# Altium schematic sheet USB.SchDoc: USB interface
size A3; DrawnBy: Mogens Groth Nicolaisen; DocumentNumber: 6; SheetNumber: 6; SheetTotal: 7
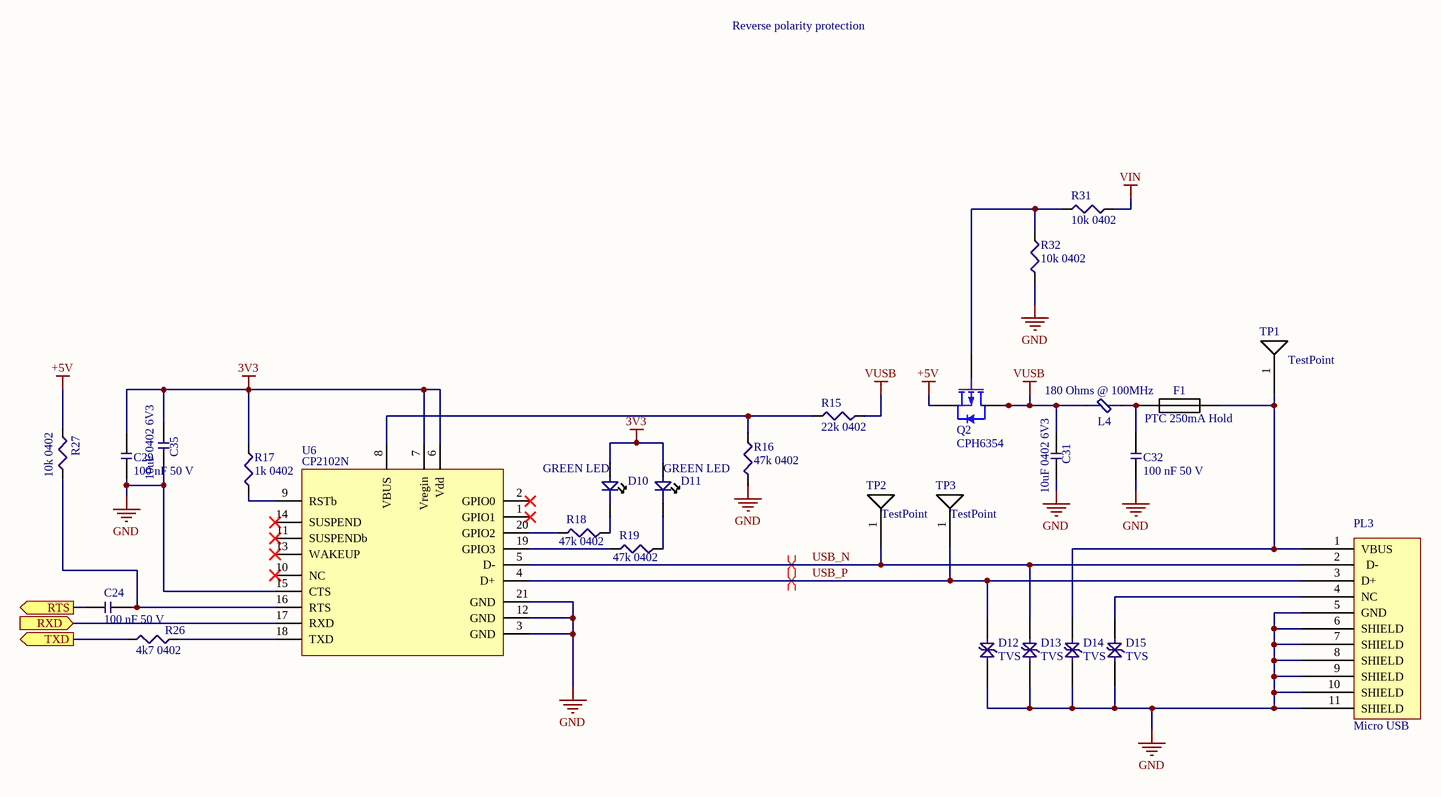
[diagram p0: USB.SchDoc]

## Parts
C24  100 nF 50 V  [CAP_0402]
C29  100 nF 50 V  [CAP_0402]
C31  10uF 0402 6V3  [CAP_0402]
C32  100 nF 50 V  [CAP_0402]
C35  10uF 0402 6V3  [CAP_0402]
D10  GREEN LED  [0402 LED]
D11  GREEN LED  [0402 LED]
D12  TVS  [RES_0402]
D13  TVS  [RES_0402]
D14  TVS  [RES_0402]
D15  TVS  [RES_0402]
F1  PTC 250mA Hold  [PTC Fuse 1206]
L4  180 Ohms @ 100MHz  [IND_0603]
PL3  Micro USB  [10118193-0001LF Micro USB]
Q2  CPH6354  [SOT95P280X95-6N]
R15  22k 0402  [RES_0402]
R16  47k 0402  [RES_0402]
R17  1k 0402  [RES_0402]
R18  47k 0402  [RES_0402]
R19  47k 0402  [RES_0402]
R26  4k7 0402  [RES_0402]
R27  10k 0402  [RES_0402]
R31  10k 0402  [RES_0402]
R32  10k 0402  [RES_0402]
TP1  TestPoint  [1x0mm]  (no BOM)
TP2  TestPoint  [1x0mm]  (no BOM)
TP3  TestPoint  [1x0mm]  (no BOM)
U6  CP2102N  [QFN50P300X300X80_HS-21N]

## Ports
RTS (out), RXD (in), TXD (out)

## Nets
3V3: C29.1 C35.2 D10.1 D11.1 R17.2 U6.6(Vdd) U6.7(Vregin)
+5V: Q2.4(SOURCE) R27.2
GND: C29.2 C31.1 C32.2 C35.1 D12.1(Anode) D13.1(Anode) D14.1(Anode) D15.1(Anode) PL3.5(GND) PL3.6(SHIELD) PL3.7(SHIELD) PL3.8(SHIELD) PL3.9(SHIELD) PL3.10(SHIELD) PL3.11(SHIELD) R16.1 R32.2 U6.3(GND) U6.12(GND) U6.15(CTS) U6.21(GND)
VIN: R31.1
VUSB: C31.2 L4.1 Q2.1(DRAIN) Q2.2(DRAIN) Q2.5(DRAIN) Q2.6(DRAIN) R15.2
RTS: C24.1 ; port RTS
RXD: U6.17(RXD) ; port RXD
TXD: R26.2 ; port TXD
USB_N: D13.2(Cathode) PL3.2(D-) TP2.1 U6.5(D-)
USB_P: D12.2(Cathode) PL3.3(D+) TP3.1 U6.4(D+)
NetC24_2: C24.2 R27.1 U6.16(RTS)
NetC32_1: C32.1 F1.1 L4.2
NetD10_2: D10.2 R18.1
NetD11_2: D11.2 R19.1
NetD14_2: D14.2(Cathode) F1.2 PL3.1(VBUS) TP1.1
NetD15_2: D15.2(Cathode) PL3.4(NC)
NetQ2_3: Q2.3(GATE) R31.2 R32.1
NetR15_1: R15.1 R16.2 U6.8(VBUS)
NetR17_1: R17.1 U6.9(RSTb)
NetR18_2: R18.2 U6.20(GPIO2)
NetR19_2: R19.2 U6.19(GPIO3)
NetR26_1: R26.1 U6.18(TXD)

Not connected (* = marked no-connect by the designer): U6 1(GPIO1)* 2(GPIO0)* 10(NC)* 11(SUSPENDb)* 13(WAKEUP)* 14(SUSPEND)*

## Layout directives
differential pair: USB_N, USB_P

## Notes on the sheet
- Reverse polarity protection
- ON Development
- Title:
- Size:
- A3
- Drawn By:
- Date:
- Sheet
- of
- Revision:

## Library data of the parts
C24 C29 C32 = CMP-00088-2: Multilayer Ceramic Capacitors MLCC - SMD/SMT .1uF 50Volts X7R +/-10% 0402 STD; Tolerance: 10%; Value: 100nF; Voltage: 50 V; Voltage Rating (DC): 50V; Capacitance: 100nF; Case/Package: 0402; Case Code (Imperial): 0402; Case Code (Metric): 1005; Dielectric: X7R; Halogen Free: Halogen Free; Height: 0.5mm; Lead Free: Lead Free; Length: 0.039inch; Max Operating Temperature: 125°C; Min Operating Temperature: -55°C; Mount: Surface Mount; Package Quantity: 10000; Packaging: Tape and Reel; Termination: SMD/SMT; Thickness: 0.022inch; Voltage Rating: 50V; Width: 0.5mm
C31 C35 = CMP-00011-3: 10uF 20% 0402 6V3 X6S; Current Rating: -; Tolerance: 20%; Value: 10uF; Voltage: 6V3
D10 D11 = CMP-008-0001-2: 0402 SMD LED; Mfg. Part Number: LTST-C281KGKT
D12-D15 = CMP-016-0004-2: TVS DIODE 12VC 8A IPP 0402; Mfg. Part Number: GG040205100N2P
F1 = CMP-017-0000-3: PTC RESET FUSE 24V 250MA 1206; Mfg. Part Number: 0ZCJ0025AF2E; Case/Package: 1206; Mount: SMD; Pins: 2; RoHS: Yes
L4 = CMP-ROOT-0005-2: FERRITE BEAD 180 OHM 0603 1LN; Mfg. Part Number: BLM18PG181SN1D; Current: 1.5A; Value: 180 Ohm; Case/Package: 0603
PL3 = CMP-003-0000-3: CONN USB MICRO B RECPT SMT R/A; Mfg. Part Number: 10118193-0001LF
Q2 = CMP-014-0006-2: MOSFET P-CH 60V 4A CPH6; Mfg. Part Number: CPH6354-TL-W
R15 = CMP-001-0026-3: RES SMD 22K OHM 1% 1/16W 0402; Mfg. Part Number: RMCF0402FT22K0; Case/Package: 0402; Power: 1/16W; Tolerance: 1%; Value: 22k
R16 R18 R19 = CMP-001-0027-3: RES SMD 47K OHM 1% 1/16W 0402; Mfg. Part Number: RMCF0402FT47K0; Case/Package: 0402; Power: 1/16W; Tolerance: 1%; Value: 47k
R17 = CMP-001-0025-3: RES SMD 1K OHM 1% 1/16W 0402; Mfg. Part Number: CRG0402F1K0; Case/Package: 0402; Power: 1/16W; Tolerance: 1%; Value: 1k
R26 = CMP-001-0029-3: RES SMD 4.7K OHM 1% 1/16W 0402; Mfg. Part Number: RC1005F472CS; Tolerance: 1; Case/Package: 0402; Power: 1/16W; Value: 4k7
R27 R31 R32 = CMP-001-0019-3: RES SMD 10K OHM 1% 1/16W 0402; Mfg. Part Number: RMCF0402FT10K0; Case/Package: 0402; Power: 1/16 W; Tolerance: 1 %; Value: 10k
TP1-TP3 = CMP-ROOT-0006-0.0
U6 = CMP-00038-5: IC BRIDGE USB TO UART 20QFN; Mfg. Part Number: CP2102N-A01-GQFN20